# EAGLE design Speedometer_Drive_Board (EAGLE 9.2.2)
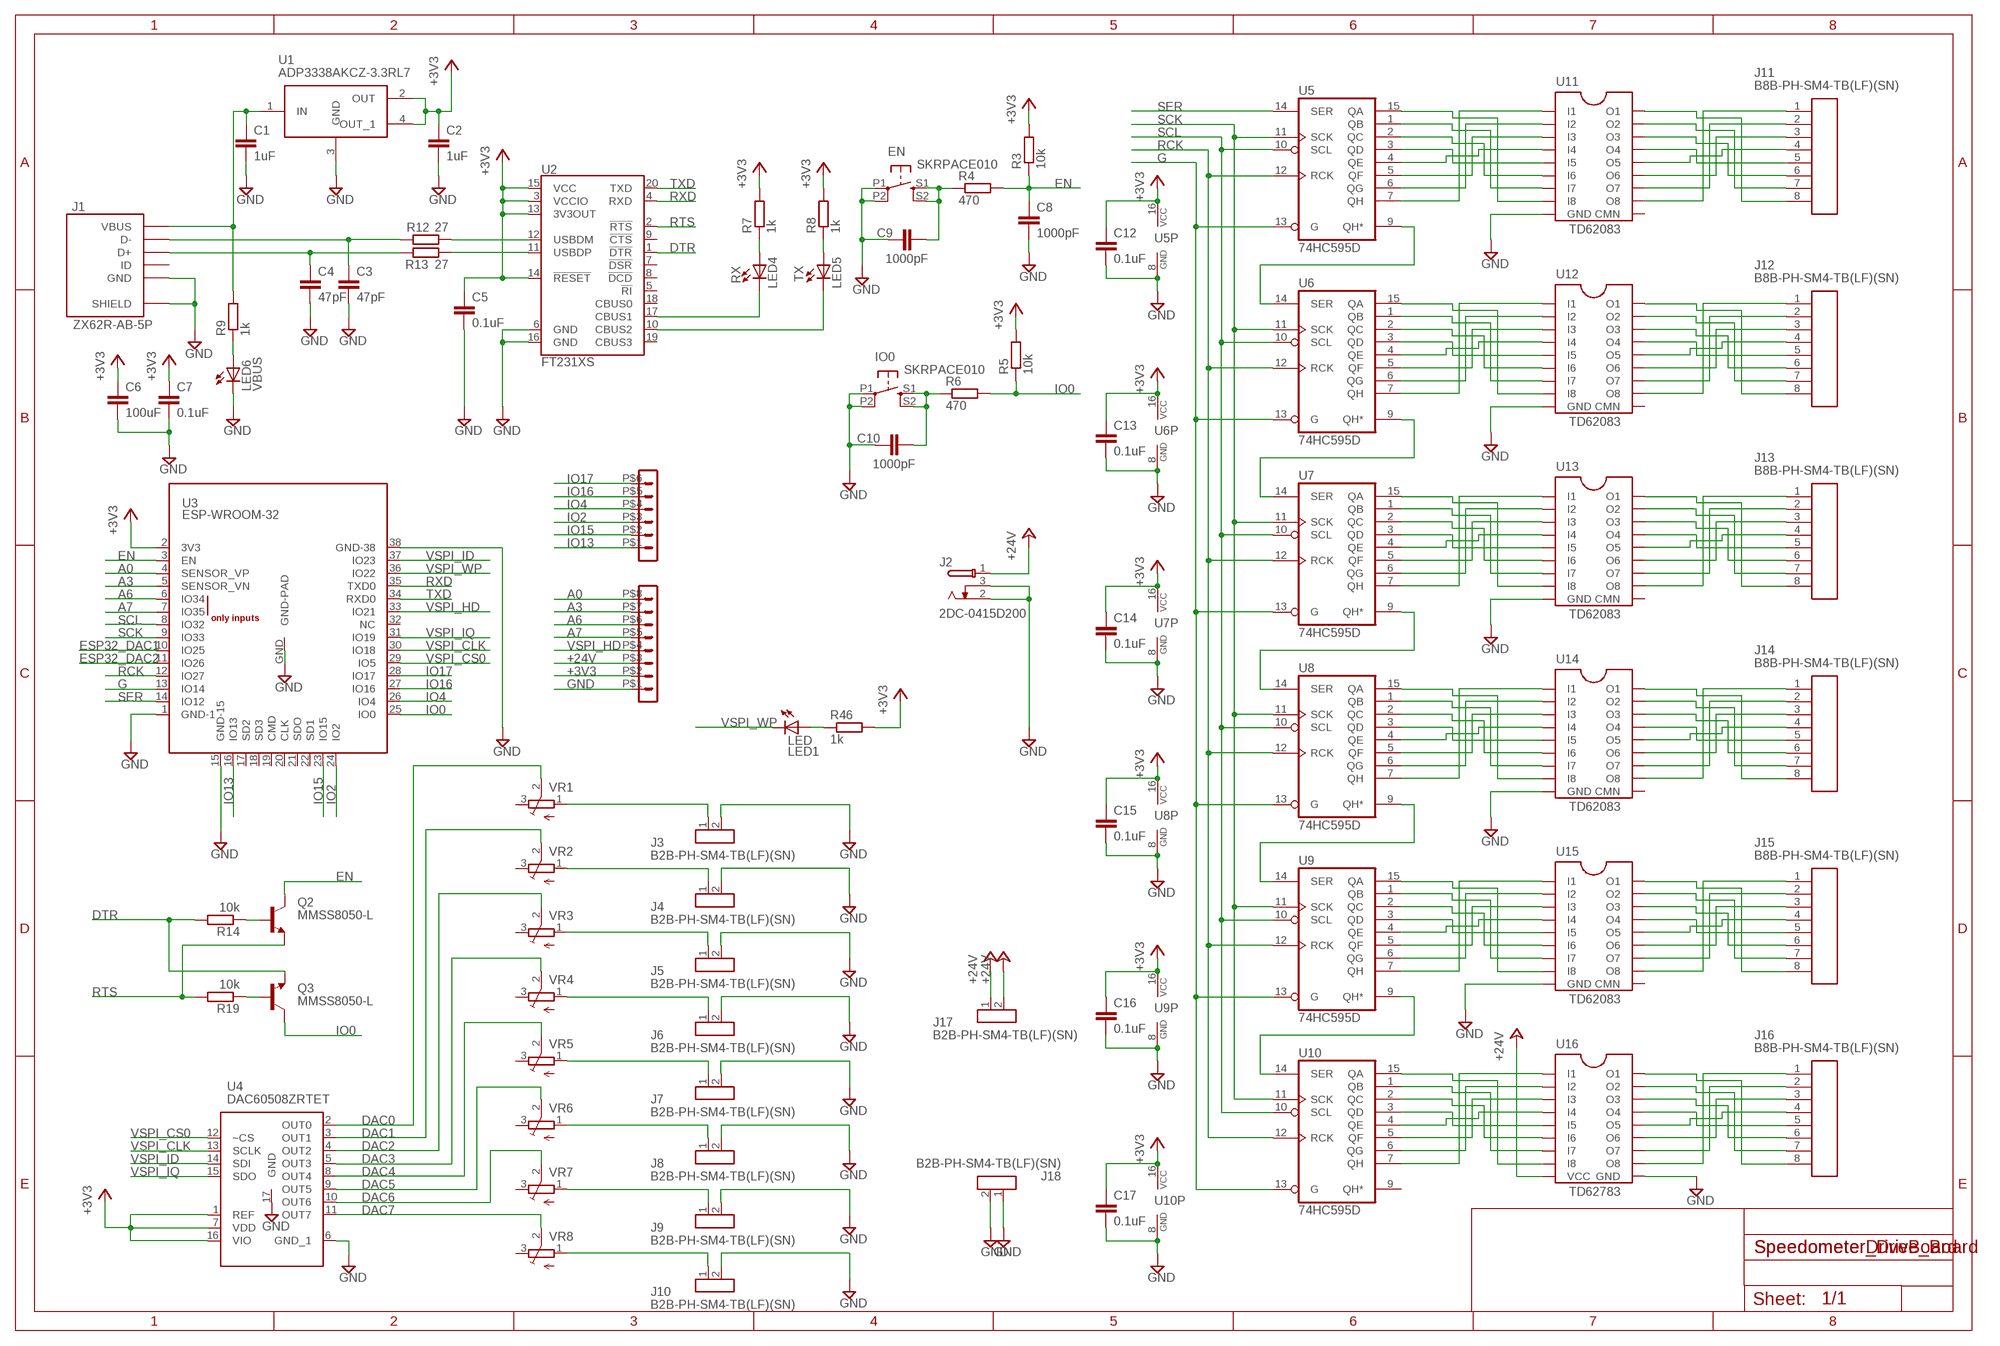
[diagram p0: schematic, sheet 1]

## Parts
C1  1uF  C-EUC0603  [C0603]
C2  1uF  C-EUC0603  [C0603]
C3  47pF  C-EUC0603  [C0603]
C4  47pF  C-EUC0603  [C0603]
C5  0.1uF  C-EUC0603  [C0603]
C6  100uF  C-EUC1210  [C1210]
C7  0.1uF  C-EUC0603  [C0603]
C8  1000pF  C-EUC0603  [C0603]
C9  1000pF  C-EUC0603  [C0603]
C10  1000pF  C-EUC0603  [C0603]
C12  0.1uF  C-EUC0603  [C0603]
C13  0.1uF  C-EUC0603  [C0603]
C14  0.1uF  C-EUC0603  [C0603]
C15  0.1uF  C-EUC0603  [C0603]
C16  0.1uF  C-EUC0603  [C0603]
C17  0.1uF  C-EUC0603  [C0603]
EN  SKRPACE010  [SKRPACE010]
IO0  SKRPACE010  [SKRPACE010]
J1  ZX62R-AB-5P  [ZX62R-B-5PA]
J2  2DC-0415D200  [2DC-0415D200]
J3  B2B-PH-SM4-TB(LF)(SN)  [SAMACSYS_PARTS_B2B-PH-SM4-TB]
J4  B2B-PH-SM4-TB(LF)(SN)  [SAMACSYS_PARTS_B2B-PH-SM4-TB]
J5  B2B-PH-SM4-TB(LF)(SN)  [SAMACSYS_PARTS_B2B-PH-SM4-TB]
J6  B2B-PH-SM4-TB(LF)(SN)  [SAMACSYS_PARTS_B2B-PH-SM4-TB]
J7  B2B-PH-SM4-TB(LF)(SN)  [SAMACSYS_PARTS_B2B-PH-SM4-TB]
J8  B2B-PH-SM4-TB(LF)(SN)  [SAMACSYS_PARTS_B2B-PH-SM4-TB]
J9  B2B-PH-SM4-TB(LF)(SN)  [SAMACSYS_PARTS_B2B-PH-SM4-TB]
J10  B2B-PH-SM4-TB(LF)(SN)  [SAMACSYS_PARTS_B2B-PH-SM4-TB]
J11  B8B-PH-SM4-TB(LF)(SN)  [SAMACSYS_PARTS_B8B-PH-SM4-TB]
J12  B8B-PH-SM4-TB(LF)(SN)  [SAMACSYS_PARTS_B8B-PH-SM4-TB]
J13  B8B-PH-SM4-TB(LF)(SN)  [SAMACSYS_PARTS_B8B-PH-SM4-TB]
J14  B8B-PH-SM4-TB(LF)(SN)  [SAMACSYS_PARTS_B8B-PH-SM4-TB]
J15  B8B-PH-SM4-TB(LF)(SN)  [SAMACSYS_PARTS_B8B-PH-SM4-TB]
J16  B8B-PH-SM4-TB(LF)(SN)  [SAMACSYS_PARTS_B8B-PH-SM4-TB]
J17  B2B-PH-SM4-TB(LF)(SN)  [SAMACSYS_PARTS_B2B-PH-SM4-TB]
J18  B2B-PH-SM4-TB(LF)(SN)  [SAMACSYS_PARTS_B2B-PH-SM4-TB]
J19  PIN_HEADER_MALE_1X06_06P  [PIN_HEADER_MALE_1X06_06P]
J20  PIN_HEADER_MALE_1X08_08P  [PIN_HEADER_MALE_1X08_08P]
LED  LED1  LEDCHIPLED_0603  [CHIPLED_0603]
LED4  RX  LEDCHIPLED_0603  [CHIPLED_0603]
LED5  TX  LEDCHIPLED_0603  [CHIPLED_0603]
LED6  VBUS  LEDCHIPLED_0603  [CHIPLED_0603]
Q2  MMSS8050-L  [SOT23]
Q3  MMSS8050-L  [SOT23]
R3  10k  R-EU_R0603  [R0603]
R4  470  R-EU_R0603  [R0603]
R5  10k  R-EU_R0603  [R0603]
R6  470  R-EU_R0603  [R0603]
R7  1k  R-EU_R0603  [R0603]
R8  1k  R-EU_R0603  [R0603]
R9  1k  R-EU_R0603  [R0603]
R12  27  R-EU_R0603  [R0603]
R13  27  R-EU_R0603  [R0603]
R14  10k  R-EU_R0603  [R0603]
R19  10k  R-EU_R0603  [R0603]
R46  1k  R-EU_R0603  [R0603]
U1  ADP3338AKCZ-3.3RL7  [SOT230P700X180-4N]
U2  FT231XS  [SSOP20_L]
U3  ESP-WROOM-32  [ESP-WROOM-32]
U4  DAC60508ZRTET  [SAMACSYS_PARTS_QFN50P300X300X80-17N]
U5  74HC595D  [SO16]
U6  74HC595D  [SO16]
U7  74HC595D  [SO16]
U8  74HC595D  [SO16]
U9  74HC595D  [SO16]
U10  74HC595D  [SO16]
U11  TD62083  [SO18]
U12  TD62083  [SO18]
U13  TD62083  [SO18]
U14  TD62083  [SO18]
U15  TD62083  [SO18]
U16  TD62783  [SO18]
VR1  TRIM_EU-SM-42/43W  [SM-42/43W]
VR2  TRIM_EU-SM-42/43W  [SM-42/43W]
VR3  TRIM_EU-SM-42/43W  [SM-42/43W]
VR4  TRIM_EU-SM-42/43W  [SM-42/43W]
VR5  TRIM_EU-SM-42/43W  [SM-42/43W]
VR6  TRIM_EU-SM-42/43W  [SM-42/43W]
VR7  TRIM_EU-SM-42/43W  [SM-42/43W]
VR8  TRIM_EU-SM-42/43W  [SM-42/43W]

## Nets
+3V3: C2.1 C5.1 C6.1 C7.1 C12.1 C13.1 C14.1 C15.1 C16.1 C17.1 J20.P$2 R3.2 R5.2 R7.2 R8.2 R46.2 U1.2(OUT) U1.4(OUT_1) U2.3(VCCIO) U2.13(3V3OUT) U2.14(!RESET) U2.15(VCC) U3.2(3V3) U4.1(REF) U4.7(VDD) U4.16(VIO) U5.16(VCC) U6.16(VCC) U7.16(VCC) U8.16(VCC) U9.16(VCC) U10.16(VCC)
+24V: J2.1 J17.1 J17.2 J20.P$3 U16.9(VCC)
A0: J20.P$8 U3.4(SENSOR_VP)
A3: J20.P$7 U3.5(SENSOR_VN)
A6: J20.P$6 U3.6(IO34)
A7: J20.P$5 U3.7(IO35)
D2_N1 [diffrencial pair]: R12.2 U2.12(USBDM)
D2_P1 [diffrencial pair]: R13.2 U2.11(USBDP)
D_N1 [diffrencial pair]: C3.1 J1.D- R12.1
D_P1 [diffrencial pair]: C4.1 J1.D+ R13.1
DAC0: U4.2(OUT0) VR1.2(S)
DAC1: U4.3(OUT1) VR2.2(S)
DAC2: U4.4(OUT2) VR3.2(S)
DAC3: U4.5(OUT3) VR4.2(S)
DAC4: U4.8(OUT4) VR5.2(S)
DAC5: U4.9(OUT5) VR6.2(S)
DAC6: U4.10(OUT6) VR7.2(S)
DAC7: U4.11(OUT7) VR8.2(S)
DTR: Q3.E R14.2 U2.1(!DTR)
EN: C8.1 Q2.C R3.1 R4.2 U3.3(EN)
ESP32_DAC1: U3.10(IO25)
ESP32_DAC2: U3.11(IO26)
G: U3.13(IO14) U5.13(G) U6.13(G) U7.13(G) U8.13(G) U9.13(G) U10.13(G)
GND: C1.2 C2.2 C3.2 C4.2 C5.2 C6.2 C7.2 C8.2 C9.1 C10.1 C12.2 C13.2 C14.2 C15.2 C16.2 C17.2 EN.P1(P) EN.P2(P1) IO0.P1(P) IO0.P2(P1) J1.GND J1.SHIELD@1(SHIELD) J1.SHIELD@2(SHIELD) J1.SHIELD@3(SHIELD) J1.SHIELD@4(SHIELD) J2.2 J2.3 J3.2 J4.2 J5.2 J6.2 J7.2 J8.2 J9.2 J10.2 J18.1 J18.2 J20.P$1 LED6.C U1.3(GND) U2.6(GND) U2.16(GND) U3.1(GND-1) U3.15(GND-15) U3.38(GND-38) U3.GND(GND-PAD) U4.6(GND_1) U4.17(GND) U5.8(GND) U6.8(GND) U7.8(GND) U8.8(GND) U9.8(GND) U10.8(GND) U11.9(GND) U12.9(GND) U13.9(GND) U14.9(GND) U15.9(GND) U16.10(GND)
IO0: Q3.C R5.1 R6.2 U3.25(IO0)
IO2: J19.P$3 U3.24(IO2)
IO4: J19.P$4 U3.26(IO4)
IO13: J19.P$1 U3.16(IO13)
IO15: J19.P$2 U3.23(IO15)
IO16: J19.P$5 U3.27(IO16)
IO17: J19.P$6 U3.28(IO17)
N$1: U5.9(QH*) U6.14(SER)
N$2: U6.9(QH*) U7.14(SER)
N$3: U7.9(QH*) U8.14(SER)
N$4: U5.7(QH) U11.1(I1)
N$5: U5.6(QG) U11.2(I2)
N$8: U5.5(QF) U11.3(I3)
N$9: LED.A R46.1
N$10: U5.4(QE) U11.4(I4)
N$11: U5.3(QD) U11.5(I5)
N$12: U5.2(QC) U11.6(I6)
N$13: U5.1(QB) U11.7(I7)
N$14: U5.15(QA) U11.8(I8)
N$15: J11.1(S1) U11.11(O8)
N$16: J11.2(S2) U11.12(O7)
N$17: J11.3(S3) U11.13(O6)
N$18: J11.4(S4) U11.14(O5)
N$20: J11.5(S5) U11.15(O4)
N$21: J11.6(S6) U11.16(O3)
N$22: J11.7(S7) U11.17(O2)
N$23: J11.8(S8) U11.18(O1)
N$24: U7.7(QH) U13.1(I1)
N$25: U6.7(QH) U12.1(I1)
N$26: U6.6(QG) U12.2(I2)
N$27: U6.5(QF) U12.3(I3)
N$28: U6.4(QE) U12.4(I4)
N$29: U6.3(QD) U12.5(I5)
N$30: U6.2(QC) U12.6(I6)
N$31: U6.1(QB) U12.7(I7)
N$32: U6.15(QA) U12.8(I8)
N$33: J12.1(S1) U12.11(O8)
N$34: J12.2(S2) U12.12(O7)
N$35: J12.3(S3) U12.13(O6)
N$36: J12.4(S4) U12.14(O5)
N$37: J12.5(S5) U12.15(O4)
N$38: J12.6(S6) U12.16(O3)
N$39: J12.7(S7) U12.17(O2)
N$40: J12.8(S8) U12.18(O1)
N$41: U7.6(QG) U13.2(I2)
N$42: U7.5(QF) U13.3(I3)
N$43: U7.4(QE) U13.4(I4)
N$44: U7.3(QD) U13.5(I5)
N$45: U7.2(QC) U13.6(I6)
N$46: U7.1(QB) U13.7(I7)
N$47: U7.15(QA) U13.8(I8)
N$48: J13.1(S1) U13.11(O8)
N$49: J13.2(S2) U13.12(O7)
N$50: J13.3(S3) U13.13(O6)
N$51: J13.4(S4) U13.14(O5)
N$52: J13.5(S5) U13.15(O4)
N$53: J13.6(S6) U13.16(O3)
N$54: J13.7(S7) U13.17(O2)
N$55: J13.8(S8) U13.18(O1)
N$56: U8.7(QH) U14.1(I1)
N$57: U8.6(QG) U14.2(I2)
N$58: U8.5(QF) U14.3(I3)
N$59: U8.4(QE) U14.4(I4)
N$60: U8.3(QD) U14.5(I5)
N$61: U8.2(QC) U14.6(I6)
N$62: U8.1(QB) U14.7(I7)
N$63: U8.15(QA) U14.8(I8)
N$64: J14.1(S1) U14.11(O8)
N$65: J14.2(S2) U14.12(O7)
N$66: J14.3(S3) U14.13(O6)
N$67: J14.4(S4) U14.14(O5)
N$68: J14.5(S5) U14.15(O4)
N$69: J14.6(S6) U14.16(O3)
N$70: J14.7(S7) U14.17(O2)
N$71: J14.8(S8) U14.18(O1)
N$72: U9.7(QH) U15.1(I1)
N$73: U9.6(QG) U15.2(I2)
N$74: U9.5(QF) U15.3(I3)
N$75: U9.4(QE) U15.4(I4)
N$76: U9.3(QD) U15.5(I5)
N$77: U9.2(QC) U15.6(I6)
N$78: U8.9(QH*) U9.14(SER)
N$79: U9.1(QB) U15.7(I7)
N$80: U9.15(QA) U15.8(I8)
N$81: J15.1(S1) U15.11(O8)
N$82: J15.2(S2) U15.12(O7)
N$83: J15.3(S3) U15.13(O6)
N$84: J15.4(S4) U15.14(O5)
N$85: J15.5(S5) U15.15(O4)
N$86: J15.6(S6) U15.16(O3)
N$87: J15.7(S7) U15.17(O2)
N$88: J15.8(S8) U15.18(O1)
N$89: U10.7(QH) U16.1(I1)
N$90: U10.6(QG) U16.2(I2)
N$91: U10.5(QF) U16.3(I3)
N$92: U10.4(QE) U16.4(I4)
N$93: U10.3(QD) U16.5(I5)
N$94: U10.2(QC) U16.6(I6)
N$95: U10.1(QB) U16.7(I7)
N$96: U9.9(QH*) U10.14(SER)
N$97: U10.15(QA) U16.8(I8)
N$98: J16.1(S1) U16.11(O8)
N$99: J16.2(S2) U16.12(O7)
N$100: J16.3(S3) U16.13(O6)
N$101: J16.4(S4) U16.14(O5)
N$102: J16.5(S5) U16.15(O4)
N$103: J16.6(S6) U16.16(O3)
N$104: J16.7(S7) U16.17(O2)
N$105: J16.8(S8) U16.18(O1)
N$120: J10.1 VR8.1(A)
N$121: J9.1 VR7.1(A)
N$122: J8.1 VR6.1(A)
N$123: J7.1 VR5.1(A)
N$124: J3.1 VR1.1(A)
N$125: J4.1 VR2.1(A)
N$126: J5.1 VR3.1(A)
N$127: J6.1 VR4.1(A)
N$128: C9.2 EN.S1(S) EN.S2(S1) R4.1
N$129: C10.2 IO0.S1(S) IO0.S2(S1) R6.1
N$130: LED4.C U2.17(CBUS1)
N$131: LED5.C U2.10(CBUS2)
N$132: LED4.A R7.1
N$133: LED5.A R8.1
N$134: LED6.A R9.1
N$136: Q2.B R14.1
N$137: Q3.B R19.1
RCK: U3.12(IO27) U5.12(RCK) U6.12(RCK) U7.12(RCK) U8.12(RCK) U9.12(RCK) U10.12(RCK)
RTS: Q2.E R19.2 U2.2(!RTS)
RXD: U2.4(RXD) U3.35(TXD0)
SCK: U3.9(IO33) U5.11(SCK) U6.11(SCK) U7.11(SCK) U8.11(SCK) U9.11(SCK) U10.11(SCK)
SCL: U3.8(IO32) U5.10(SCL) U6.10(SCL) U7.10(SCL) U8.10(SCL) U9.10(SCL) U10.10(SCL)
SER: U3.14(IO12) U5.14(SER)
TXD: U2.20(TXD) U3.34(RXD0)
VBUS3: C1.1 J1.VCC(VBUS) R9.2 U1.1(IN)
VSPI_CLK: U3.30(IO18) U4.13(SCLK)
VSPI_CS0: U3.29(IO5) U4.12(~CS)
VSPI_HD: J20.P$4 U3.33(IO21)
VSPI_ID: U3.37(IO23) U4.14(SDI)
VSPI_IQ: U3.31(IO19) U4.15(SDO)
VSPI_WP: LED.C U3.36(IO22)
Unconnected: J1.ID U2.5(!RI) U2.7(!DSR) U2.8(!DCD) U2.9(!CTS) U2.18(CBUS0) U2.19(CBUS3) U3.17(SD2) U3.18(SD3) U3.19(CMD) U3.20(CLK) U3.21(SDO) U3.22(SD1) U3.32(NC) U10.9(QH*) U11.10(CMN) U12.10(CMN) U13.10(CMN) U14.10(CMN) U15.10(CMN) VR1.3(E) VR2.3(E) VR3.3(E) VR4.3(E) VR5.3(E) VR6.3(E) VR7.3(E) VR8.3(E)

## Notes on the sheet
- SpeedometerDriveBoard

## Library data of the parts
C1-C10 C12-C17 = taki-library:C-EU: CAPACITOR, European symbol
EN IO0 = taki-library:SKRPACE010
J1 = taki-library:ZX62
J2 = taki-library:2DC-0415D200
J3-J10 J17 J18 = library:B2B-PH-SM4-TB(LF)(SN): Wire-To-Board Connector, PH Series, 2 Contacts, Header, 2 mm, Surface Mount, 1 Rows Source: Datasheet <http://uk.rs-online.com/web/p/products/6881325P>; DESCRIPTION: Wire-To-Board Connector, PH Series, 2 Contacts, Header, 2 mm, Surface Mount, 1 Rows; HEIGHT: mm; MANUFACTURER_NAME: JST (JAPAN SOLDERLESS TERMINALS); MANUFACTURER_PART_NUMBER: B2B-PH-SM4-TB(LF)(SN); RS_PART_NUMBER: 6881325P
J11-J16 = library:B8B-PH-SM4-TB(LF)(SN): PH SMT top entry shrouded header 8 way JST PH Series, 2mm Pitch 8 Way 1 Row Straight PCB Header, Solder Termination, 2A Source: Datasheet <http://uk.rs-online.com/web/p/products/1667263>; DESCRIPTION: PH SMT top entry shrouded header 8 way JST PH Series, 2mm Pitch 8 Way 1 Row Straight PCB Header, Solder Termination, 2A; HEIGHT: mm; MANUFACTURER_NAME: JST (JAPAN SOLDERLESS TERMINALS); MANUFACTURER_PART_NUMBER: B8B-PH-SM4-TB(LF)(SN); RS_PART_NUMBER: 1667263
J19 = 180118 Library by matsu:PIN_HEADER_MALE_1X06_06P
J20 = 180118 Library by matsu:PIN_HEADER_MALE_1X08_08P
LED LED4-LED6 = taki-library:LED: LED OSRAM: - CHIPLED LG R971, LG N971, LY N971, LG Q971, LY Q971, LO R971, LY R971 LH N974, LH R974 LS Q976, LO Q976, LY Q976 LO Q996 - Hyper CHIPLED LW Q18S LB Q993, LB Q99A, LB R99A - SideLED LS A670, LO A670, LY A670, LG A670, LP A670 LB A673, LV A673, LT A673, LW A673 LH A674 LY A675 LS A676, LA A676, LO A676, LY A676, LW A676 LS A679, LY A679, LG A679 - Hyper Micro SIDELED® LS Y876, LA Y876, LO Y876, LY Y876 LT Y87S - SmartLED LW L88C, LW L88S LB L89C, LB L89S, LG L890 LS L89K, LO L89K, LY L89K LS L896, LA L896, LO L896, LY L896 - TOPLED LS T670, LO T670, LY T670, LG T670, LP T670 LSG T670, LSP T670, LSY T670, LOP T670, LYG T670 LG T671, LOG T671, LSG T671 LB T673, LV T673, LT T673, LW T673 LH T674 LS T676, LA T676, LO T676, LY T676, LB T676, LH T676, LSB T676, LW T676 LB T67C, LV T67C, LT T67C, LS T67K, LO T67K, LY T67K, LW E67C LS E67B, LA E67B, LO E67B, LY E67B, LB E67C, LV E67C, LT E67C LW T67C LS T679, LY T679, LG T679 LS T770, LO T770, LY T770, LG T770, LP T770 LB T773, LV T773, LT T773, LW T773 LH T774 LS E675, LA E675, LY E675, LS T675 LS T776, LA T776, LO T776, LY T776, LB T776 LHGB T686 LT T68C, LB T68C - Hyper Mini TOPLED® LB M676 - Mini TOPLED Santana® LG M470 LS M47K, LO M47K, LY M47K Source: http://www.osram.convergy.de LUXEON: - LUMILED® LXK2-PW12-R00, LXK2-PW12-S00, LXK2-PW14-U00, LXK2-PW14-V00 LXK2-PM12-R00, LXK2-PM12-S00, LXK2-PM14-U00 LXK2-PE12-Q00, LXK2-PE12-R00, LXK2-PE12-S00, LXK2-PE14-T00, LXK2-PE14-U00 LXK2-PB12-K00, LXK2-PB12-L00, LXK2-PB12-M00, LXK2-PB14-N00, LXK2-PB14-P00, LXK2-PB14-Q00 LXK2-PR12-L00, LXK2-PR12-M00, LXK2-PR14-Q00, LXK2-PR14-R00 LXK2-PD12-Q00, LXK2-PD12-R00, LXK2-PD12-S00 LXK2-PH12-R00, LXK2-PH12-S00 LXK2-PL12-P00, LXK2-PL12-Q00, LXK2-PL12-R00 Source: www.luxeon.com KINGBRIGHT: KA-3528ASYC Source: www.kingbright.com
Q2 Q3 = taki-library:MMSS8050: Bipolar (BJT) Transistor NPN 25V 1.5A 100MHz 625mW Surface Mount SOT-23; DIGIKEY_URL: https://www.digikey.jp/product-detail/ja/micro-commercial-co/MMSS8050-L-TP/MMSS8050-L-TPMSCT-ND/2827203; MARUTSU_URL: https://www.marutsu.co.jp/pc/i/15861860/; STORE: MARUTSU; URL: https://www.marutsu.co.jp/pc/i/15861860/
R3-R9 R12-R14 R19 R46 = taki-library:R-EU_: RESISTOR, European symbol
U1 = library:ADP3338AKCZ-3.3RL7: LDO Regulator 3.3V 1.6A Analog Devices ADP3338AKCZ-3.3RL7, LDO Voltage Regulator, 1.6A, 3.3 V 0.8%, 2.7 8 Vin, 4-Pin SOT-223 Source: Datasheet <http://uk.rs-online.com/web/p/products/9126350>; DESCRIPTION: LDO Regulator 3.3V 1.6A Analog Devices ADP3338AKCZ-3.3RL7, LDO Voltage Regulator, 1.6A, 3.3 V 0.8%, 2.7 8 Vin, 4-Pin SOT-223; HEIGHT: 1.8mm; MANUFACTURER_NAME: Analog Devices; MANUFACTURER_PART_NUMBER: ADP3338AKCZ-3.3RL7; RS_PART_NUMBER: 9126350
U2 = taki-library:FT231X: FTDI FT231X Full Speed USB to Full-handshake UART This USB2.0 Full Speed IC offers a compact bridge to full handshake UART interfaces. The device is a UART, capable of operating up to 3MBaud, with low power consumption (8mA). The FT231X includes the complete FT-X series feature set and enables USB to be added into a system design quickly and easily over a UART interface. Datasheet <http://cdn.sparkfun.com/datasheets/Components/General%20IC/DS_FT231X.pdf> SparkFun Products SparkFun RedBoard - Programmed with Arduino <https://www.sparkfun.com/products/12757> (DEV-12757) SparkFun XBee Explorer USB <https://www.sparkfun.com/products/11812> (WRL-11812) SparkFun XBee Explorer Dongle <https://www.sparkfun.com/products/11697> (WRL-11697) SparkFun Blynk Board - ESP8266 <https://www.sparkfun.com/products/13794> (WRL-13794) SparkFun ESP8266 Thing - Dev Board <https://www.sparkfun.com/products/13711> (WRL-13711) SparkFun Block for Intel® Edison - Base <https://www.sparkfun.com/products/13045> (DEV-13045) SparkFun RedStick <https://www.sparkfun.com/products/13741> (DEV-13741) SparkFun Beefy 3 - FTDI Basic Breakout <https://www.sparkfun.com/products/13746> (DEV-13746) SparkFun FT231X Breakout <https://www.sparkfun.com/products/11736> (BOB-11736); PROD_ID: IC-11524
U3 = taki-library:ESP-WROOM-32
U4 = library:DAC60508ZRTET: TEXAS INSTRUMENTS - DAC60508ZRTET - DAC, VOLTAGE OUT, 12BIT, WQFN-16 Source: Datasheet <http://www.ti.com/lit/ds/symlink/dac70508.pdf>; DESCRIPTION: TEXAS INSTRUMENTS - DAC60508ZRTET - DAC, VOLTAGE OUT, 12BIT, WQFN-16; HEIGHT: 0.8mm; MANUFACTURER_NAME: Texas Instruments; MANUFACTURER_PART_NUMBER: DAC60508ZRTET; MOUSER_PART_NUMBER: 595-DAC60508ZRTET
U5-U10 = taki-library:74*595: 8-bit SHIFT REGISTER, output latch
U11-U15 = taki-library:TD62083: 8ch Darlington Sink Driver Source: http://akizukidenshi.com/download/TD62083AP.pdf
U16 = taki-library:TD62783: 8ch Darlington Sink Driver Source: http://akizukidenshi.com/download/TD62083AP.pdf
VR1-VR8 = 180118 Library by matsu:TRIM_EU-: POTENTIOMETER

## Net classes
1 POWER: width 0.254 mm
2 diffrencial pair: width 0.15 mm, clearance 0.3 mm to class 0, clearance 0.3 mm to class 1, clearance 0.15 mm

## Board
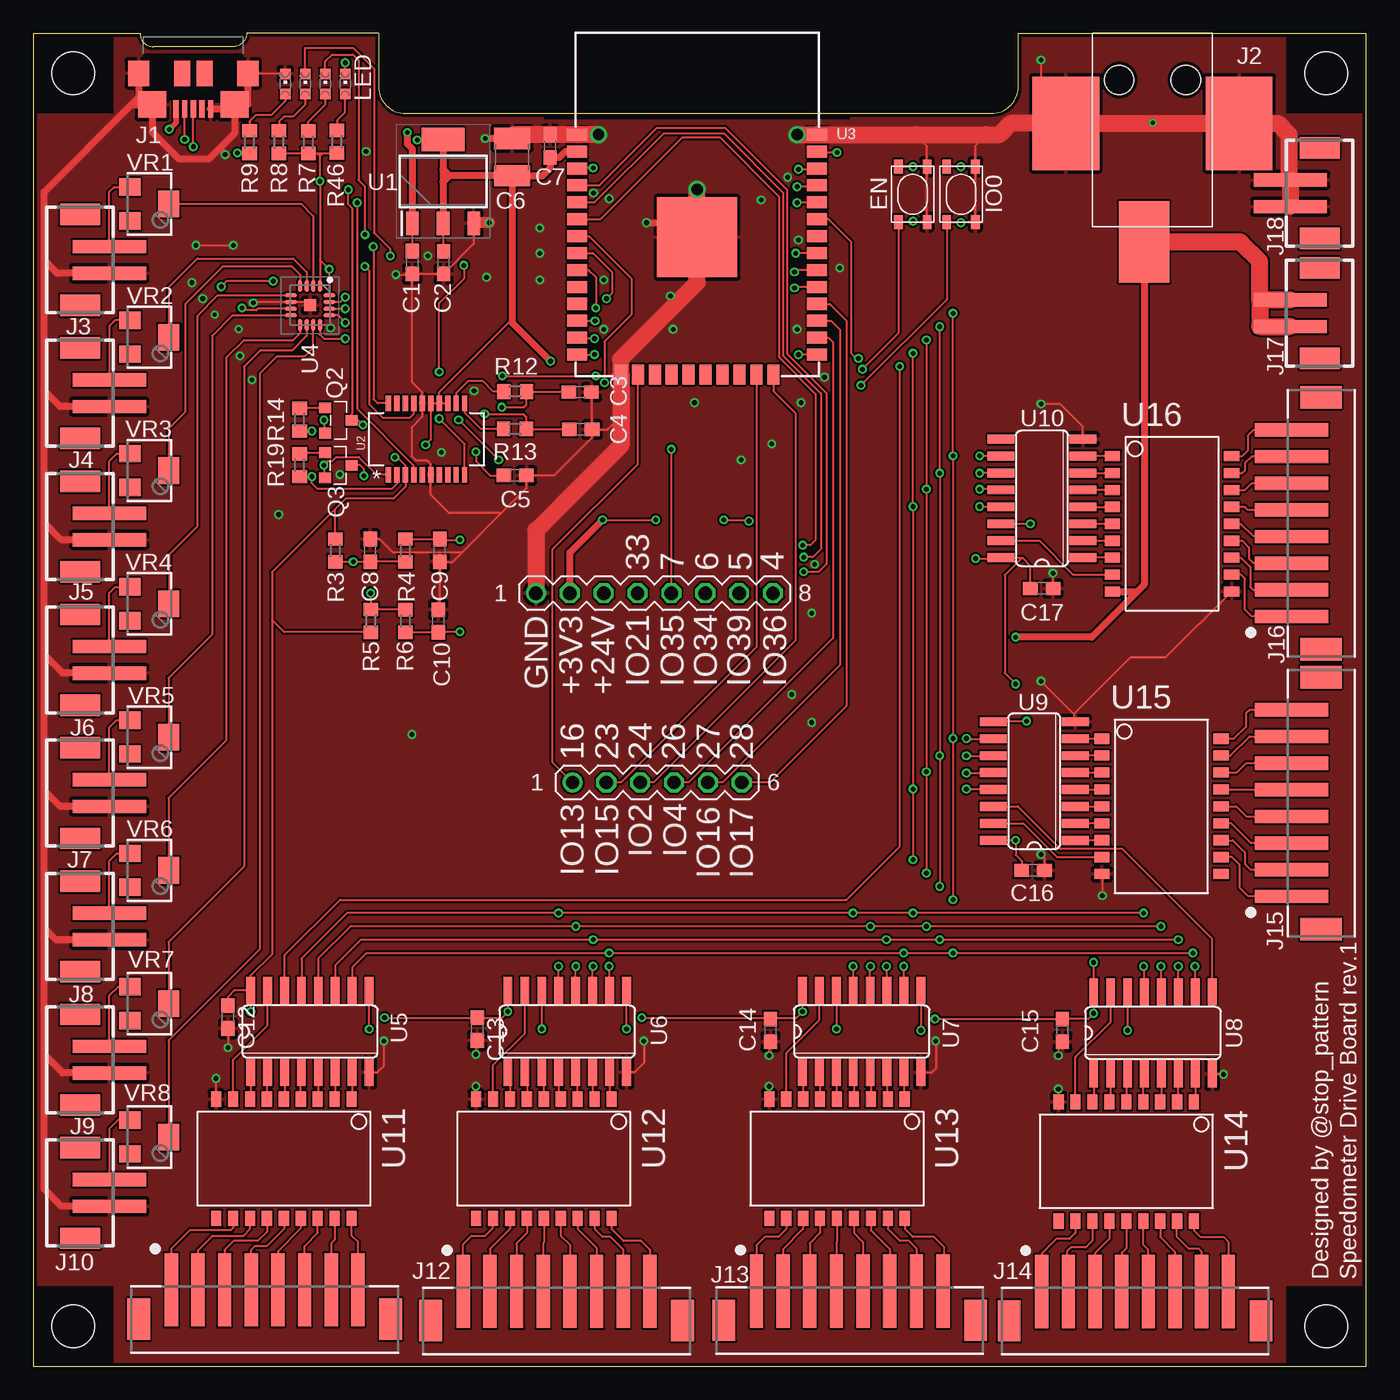
[diagram p1: board, top side]
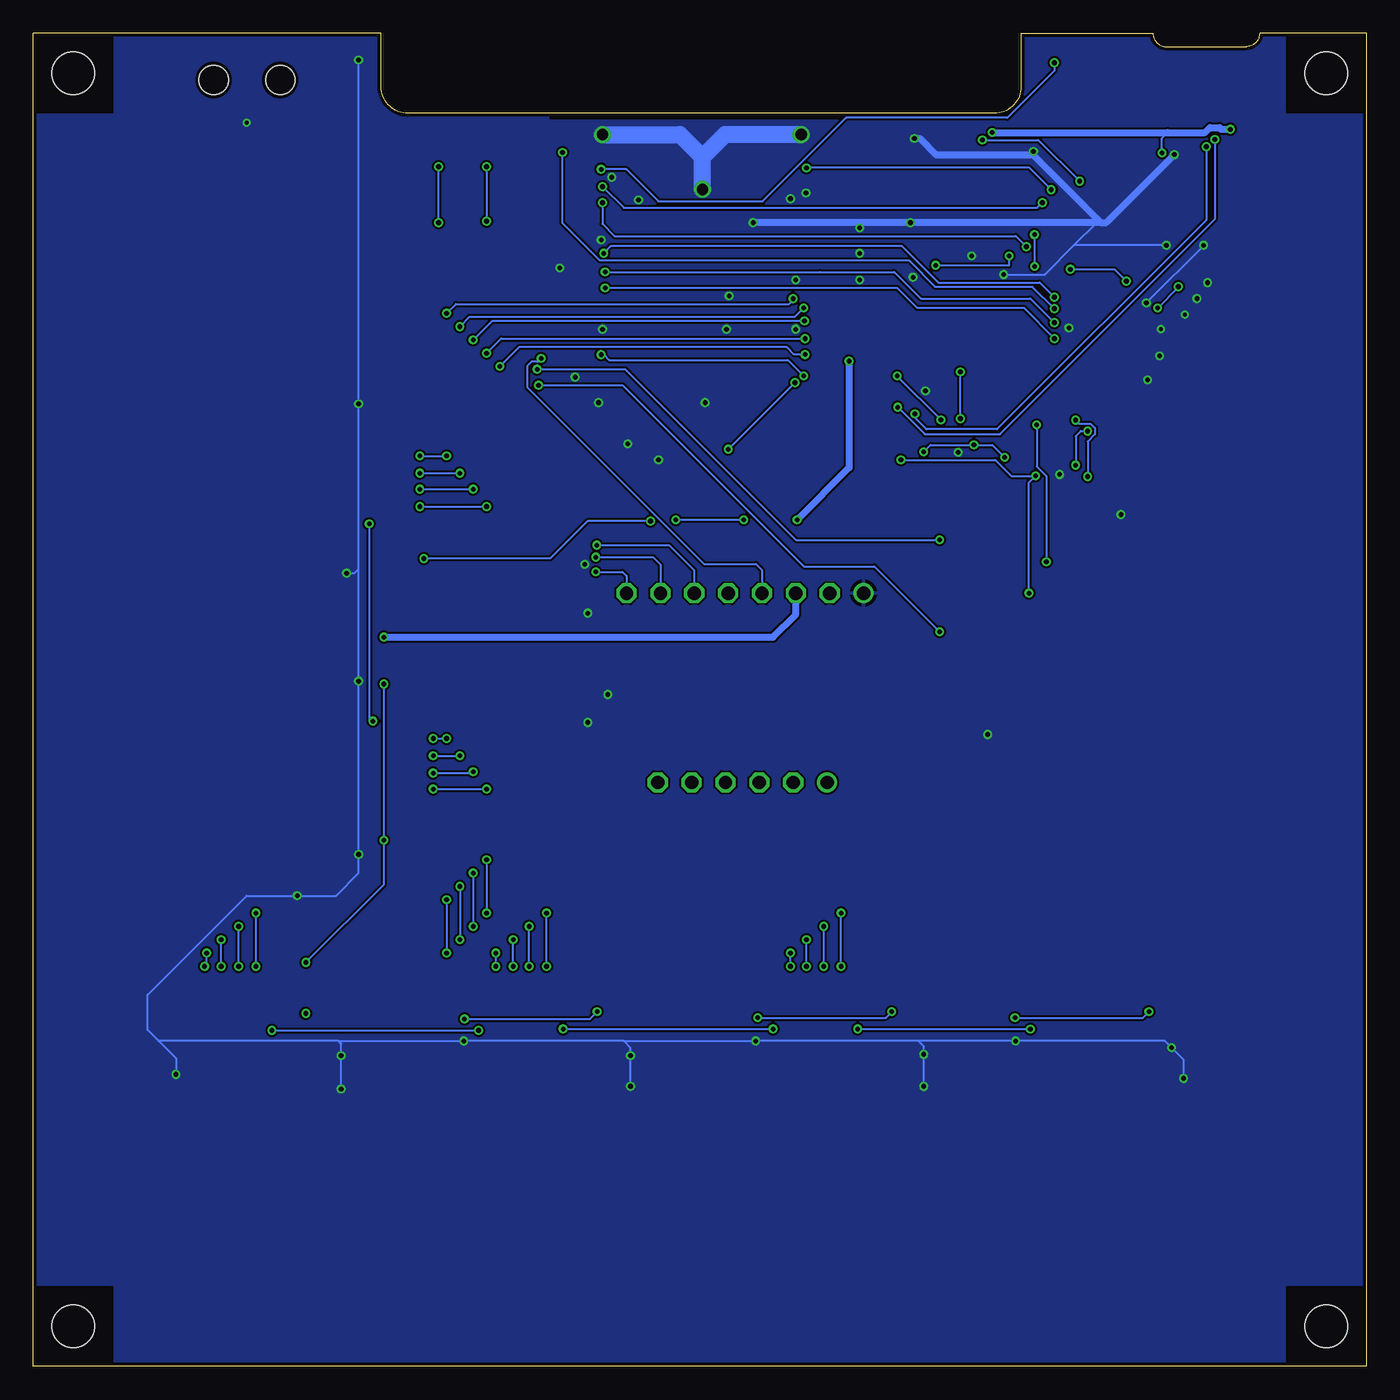
[diagram p2: board, bottom side, seen from below]

Size 100 x 100 mm. Coordinates in mm from the lower left corner, seen from the top.
Outline: 0,0 100,0 100,100 73.9,100 73.9,96 arc-90 71.9,94 27.9,94 arc-90 25.9,96 25.9,100 16,100 arc-90 15,99 9,99 arc-90 8,100 0,100 0,0
Copper layers (1*16): Top 0.035mm / dielectric 1.5mm / Bottom 0.035mm
Design rules "Elecrow_2-layer_eagle_rule": minimum track width 6mil, minimum drill 12mil, track to track 6mil, track to pad 6mil, pad to pad 6mil, via to via 6mil, smd to smd 0mil, copper to edge 10mil, drill to drill 10mil, minimum pad ring 10mil, minimum via ring 6mil, stop-mask expansion 2mil, vias tented up to drill 100mil, thermal gap 10mil
Holes 3.2 mm at 3,97 97,97 97,3 3,3
tRestrict: area 0,94 to 6,100; area 94,0 to 100,6; area 94,94 to 100,100; area 0,0 to 6,6
bRestrict: area 0,94 to 6,100; area 94,94 to 100,100; area 94,0 to 100,6; area 0,0 to 6,6

### Footprints (pad centres in the part's own frame; a part is rotated, then mirrored left to right if it is on the bottom)
C0603 = smd 1.1 x 1: 1 -0.85,0; 2 0.85,0
C1210 = smd 1.6 x 2.7: 1 -1.4,0; 2 1.4,0
SKRPACE010 = smd 1.05 x 0.65: P1 -2.075,-1.075; P2 2.075,-1.075; S1 -2.075,1.075; S2 2.075,1.075
ZX62R-B-5PA = smd 0.4 x 1.35: D+ 0,2.675; D- 0.65,2.675; GND -1.3,2.675; ID -0.65,2.675; VCC 1.3,2.675 | smd 1.2 x 1.9: NC@1 -0.85,0; NC@2 0.85,0 | smd 2.1 x 2: SHIELD@1 -3.1,2.35; SHIELD@2 3.1,2.35 | smd 1.6 x 1.9: SHIELD@3 -4.1,0; SHIELD@4 4.1,0
2DC-0415D200 = smd 6.1 x 3.8: 1 15.65,-0.63 | smd 7 x 5: 2 6.75,6.5; 3 6.75,-6.5 | hole 2.2: 3.5,2.5; 3.5,-2.5
SAMACSYS_PARTS_B2B-PH-SM4-TB = smd 1 x 5.5: 1 -1,0; 2 1,0 | smd 1.6 x 3: 3 -3.4,-2.2; 4 3.4,-2.2
SAMACSYS_PARTS_B8B-PH-SM4-TB = smd 1 x 5.5: 1 4,0; 2 2,0; 3 0,0; 4 -2,0; 5 -4,0; 6 -6,0; 7 -8,0; 8 -10,0 | smd 1.7 x 3.1: 9 -12.45,2.2; 10 6.45,2.2
PIN_HEADER_MALE_1X06_06P = drill 1: P$1 -6.35,0 | drill 1 octagon: P$2 -3.81,0; P$3 -1.27,0; P$4 1.27,0; P$5 3.81,0; P$6 6.35,0
PIN_HEADER_MALE_1X08_08P = drill 1: P$1 -8.89,0 | drill 1 octagon: P$2 -6.35,0; P$3 -3.81,0; P$4 -1.27,0; P$5 1.27,0; P$6 3.81,0; P$7 6.35,0; P$8 8.89,0
CHIPLED_0603 = smd 0.8 x 0.8: A 0,-0.75; C 0,0.75
SOT23 = smd 0.8 x 0.9: B -0.95,-1; C 0,1; E 0.95,-1
R0603 = smd 1 x 1.1: 1 -0.85,0; 2 0.85,0
SOT230P700X180-4N = smd 1.75 x 0.95: 1 -3.15,2.3; 2 -3.15,0; 3 -3.15,-2.3 | smd 1.75 x 3.2: 4 3.15,0
SSOP20_L = smd 0.4 x 1.143: 1 -2.857,-2.68; 2 -2.223,-2.68; 3 -1.587,-2.68; 4 -0.953,-2.68; 5 -0.318,-2.68; 6 0.318,-2.68; 7 0.953,-2.68; 8 1.587,-2.68; 9 2.223,-2.68; 10 2.857,-2.68; 11 2.857,2.68; 12 2.223,2.68; 13 1.587,2.68; 14 0.953,2.68; 15 0.318,2.68; 16 -0.318,2.68; 17 -0.953,2.68; 18 -1.587,2.68; 19 -2.223,2.68; 20 -2.857,2.68
ESP-WROOM-32 = smd 0.9 x 1.5: 1 7.7,9; 2 6.43,9; 3 5.16,9; 4 3.89,9; 5 2.62,9; 6 1.35,9; 7 0.08,9; 8 -1.19,9; 9 -2.46,9; 10 -3.73,9; 11 -5,9; 12 -6.27,9; 13 -7.54,9; 14 -8.81,9; 25 -8.81,-9; 26 -7.54,-9; 27 -6.27,-9; 28 -5,-9; 29 -3.73,-9; 30 -2.46,-9; 31 -1.19,-9; 32 0.08,-9; 33 1.35,-9; 34 2.62,-9; 35 3.89,-9; 36 5.16,-9; 37 6.43,-9; 38 7.7,-9 | smd 1.5 x 0.9: 15 -10.3,5.715; 16 -10.3,4.445; 17 -10.3,3.175; 18 -10.3,1.905; 19 -10.3,0.635; 20 -10.3,-0.635; 21 -10.3,-1.905; 22 -10.3,-3.175; 23 -10.3,-4.445; 24 -10.3,-5.715 | smd 6 x 6: GND 0,0
SAMACSYS_PARTS_QFN50P300X300X80-17N = smd 0.9 x 0.3: 1 -1.45,0.75; 2 -1.45,0.25; 3 -1.45,-0.25; 4 -1.45,-0.75; 9 1.45,-0.75; 10 1.45,-0.25; 11 1.45,0.25; 12 1.45,0.75 | smd 0.3 x 0.9: 5 -0.75,-1.45; 6 -0.25,-1.45; 7 0.25,-1.45; 8 0.75,-1.45; 13 0.75,1.45; 14 0.25,1.45; 15 -0.25,1.45; 16 -0.75,1.45 | smd 0.9 x 0.9: 17 0,0
SO16 = smd 0.66 x 2.032: 1 -4.445,-3.073; 2 -3.175,-3.073; 3 -1.905,-3.073; 4 -0.635,-3.073; 5 0.635,-3.073; 6 1.905,-3.073; 7 3.175,-3.073; 8 4.445,-3.073; 9 4.445,3.073; 10 3.175,3.073; 11 1.905,3.073; 12 0.635,3.073; 13 -0.635,3.073; 14 -1.905,3.073; 15 -3.175,3.073; 16 -4.445,3.073
SO18 = smd 0.762 x 1.143: 1 -5.08,-3.835; 2 -3.81,-3.835; 3 -2.54,-3.835; 4 -1.27,-3.835; 5 0,-3.835; 6 1.27,-3.835; 7 2.54,-3.835; 8 3.81,-3.835; 9 5.08,-3.835; 10 5.08,5.105; 11 3.81,5.105; 12 2.54,5.105; 13 1.27,5.105; 14 0,5.105; 15 -1.27,5.105; 16 -2.54,5.105; 17 -3.81,5.105; 18 -5.08,5.105
SM-42/43W = smd 1.3 x 1.6: 1 -1.27,-1.45; 3 1.27,-1.45 | smd 2 x 1.6: 2 0,1.45

### Placement (x,y rotation side)
C1  28.43,82.81 270 top
C2  30.78,82.79 270 top
C3  41.02,73.08 0 top
C4  41.07,70.28 0 top
C5  36.14,66.83 0 top
C6  35.92,90.72 90 top
C7  38.77,91.54 90 top
C8  25.28,61.21 90 top
C9  30.49,61.21 90 top
C10  30.38,55.91 270 top
C12  14.6,26.2 270 top
C13  33.3,25.3 270 top
C14  55.3,25.2 270 top
C15  77.2,25.2 270 top
C16  75,37.2 0 top
C17  75.65,58.35 0 top
EN  65.98,87.92 90 top
IO0  69.61,87.92 90 top
J1  12,97 180 top
J2  83.97,100 270 top
J3  5.7,83 270 top
J4  5.7,73 270 top
J5  5.7,63 270 top
J6  5.7,53 270 top
J7  5.7,43 270 top
J8  5.7,33 270 top
J9  5.7,23 270 top
J10  5.7,13 270 top
J11  14.35,5.73 180 top
J12  36.25,5.62 180 top
J13  58.25,5.64 180 top
J14  79.65,5.61 180 top
J15  94.4,39.25 270 top
J16  94.41,60.25 270 top
J17  94.3,79 90 top
J18  94.3,88 90 top
J19  46.8,43.8 0 top
J20  46.6,58 0 top
LED  23.4,96.2 0 top
LED4  21.9,96.2 0 top
LED5  20.4,96.2 0 top
LED6  18.9,96.2 0 top
Q2  22.89,70.96 270 top
Q3  22.88,67.59 270 top
R3  22.65,61.21 90 top
R4  27.91,61.21 270 top
R5  25.33,55.92 270 top
R6  27.92,55.91 90 top
R7  20.63,91.83 270 top
R8  18.43,91.84 270 top
R9  16.23,91.85 270 top
R12  36.15,73.12 180 top
R13  36.13,70.32 180 top
R14  19.98,71.01 270 top
R19  19.98,67.59 270 top
R46  22.78,91.87 270 top
U1  30.74,88.89 90 top
U2  29.5,69.56 0 top
U3  49.8,84.7 90 top
U4  20.76,79.59 270 top
U5  20.75,25.11 0 top
U6  40.05,25.11 0 top
U7  62.15,25.11 0 top
U8  84,25 0 top
U9  75.1,43.9 90 top
U10  75.68,65.11 90 top
U11  18.8,16.2 180 top
U12  38.3,16.2 180 top
U13  60.3,16.2 180 top
U14  82,16 180 top
U15  84,42 270 top
U16  84.8,63.2 270 top
VR1  8.7,87.2 270 top
VR2  8.7,77.2 270 top
VR3  8.7,67.2 270 top
VR4  8.7,57.2 270 top
VR5  8.7,47.2 270 top
VR6  8.7,37.2 270 top
VR7  8.7,27.2 270 top
VR8  8.7,17.2 270 top

### Tracks (layer width: path | path; a pad name or v marks a point on that pad's centre or on a via)
+3V3  (via drill 0.35)
  Top 0.152: U10.16 72.9,60.66 | 72.9,60.66 74.19,60.66 | U2.14 U2.15 29.82,69.51 v29.43,69.12 | U2.14 U2.13 | v27.12,68.18 27.31,68.18 27.91,67.58 U2.3 27.91,65.98 27.01,65.08 23.41,65.08 22.65,64.32 | U1.2 30.74,83.68 C2.1 | U4.1 21.54,81.07 21.5,81.11 21.5,83 | 21.5,83 v21.5,88.9 21.5,90.78 | U7.16 v57.7,26.61 v57.7,26.6 57.25,26.15 55.3,26.15 | U6.16 v35.6,26.6 35.15,26.15 C13.1 v26.35,26.15 | v16.3,26.6 v16.3,26.61 U5.16 | v33.2,68.6 33.2,67.9 34.27,66.83 C5.1 | v79.56,30.3 U8.16 v79.56,26.48 v79.56,26.47 79.14,26.05 C15.1 v67.65,26.05 | 74.19,60.66 72.89,59.36 72.89,51.99 v73.7,51.18 | U5.16 16.3,29.3 17.9,30.9 17.9,56 | 17.9,56 17.9,59.57 22.65,64.32 | R3.2 22.65,64.32 | R5.2 18.83,55.07 17.9,56 | R8.2 R7.2 21.3,90.98 | R46.2 22.74,90.98 21.7,90.98 | 21.7,90.98 21.3,90.98 | 21.5,90.78 21.7,90.98 | U2.14 30.45,73.08 35.92,78.54 35.92,78.9 | 21.5,90.78 21.3,90.98 | v28.8,92 30.7,92 U1.4 | v42.7,63.5 v46.7,63.5 | v51.8,63.5 53.59,63.5 v53.69,63.4 | v70.7,60.6 72.83,60.6 72.9,60.66 | C16.1 74.15,37.9 73.7,38.35 v73.7,39.46 72.74,39.46 72.6,39.6 72.17,39.6 U9.16 | C17.1 74.8,60.05 74.19,60.66 | U5.16 15.08,28.18 14.6,27.7 C12.1 | v45.65,26.15 55.3,26.15 | C14.1 55.3,26.15 | 21.5,83 v22.2,82.3 v22.21,82.29 U4.16 | U4.7 16.84,79.34 16.73,79.23 15.81,79.23 v15.65,79.4 | v18,81.4 14.5,81.4 v14.1,81
  Top 0.508: J20.P$2 40.25,61.05 v42.7,63.5 | 35.92,89.3 C6.1 31.22,89.32 | 35.92,89.3 35.92,78.9 35.92,78.28 v38.8,75.4 | 35.92,89.3 38.18,89.3 38.77,89.89 C7.1 39.47,90.69 39.91,91.13 U3.2 | U1.4 30.74,89.8 | 30.74,89.8 30.74,88.84 | 30.74,88.84 U1.2 | 31.22,89.32 30.74,89.8 | 31.22,89.32 30.74,88.84
  Bottom 0.152: v27.12,68.18 28.06,69.12 v29.43,69.12 32.68,69.12 v33.2,68.6 | v21.5,88.9 24.6,92 v28.8,92 | v67.65,26.05 58.25,26.05 v57.7,26.6 | v45.65,26.15 36.05,26.15 v35.6,26.6 | v26.35,26.15 16.75,26.15 v16.3,26.6 | v79.56,30.3 73.7,36.16 v73.7,39.46 v73.7,51.18 | v46.7,63.5 v51.8,63.5 | v53.69,63.4 58.41,63.4 61.22,60.6 v70.7,60.6 | v15.65,79.4 14.1,80.94 v14.1,81 | v22.2,82.3 18.9,82.3 v18,81.4
  Bottom 0.508: v38.8,75.4 38.8,67.4 v42.7,63.5
+24V  (via drill 0.35)
  Top 0.508: 90.6,84.3 90.55,84.35 | J2.1 83.34,58.64 83.1,58.4 82.82,58.12 | 82.82,58.12 79.4,54.7 v73.7,54.7 | U16.9 82.82,58.12
  Top 1.27: 90.6,84.3 92,82.9 92,80 | J17.2 92,80 | J17.1 92,78 92,80 | 90.55,84.35 J2.1
  Bottom 0.508: v73.7,54.7 44.49,54.7 42.79,56.4 J20.P$3
A0  (via drill 0.35)
  Top 0.152: U3.4 42.49,88.59 46.8,92.9 51.9,92.9 56.54,88.26 56.54,75.96 59.49,73.01 59.49,60.2 58.9,59.6 v57.8,59.6
  Bottom 0.152: v57.8,59.6 55.8,59.6 55.49,59.29 J20.P$8
A3  (via drill 0.35)
  Top 0.152: U3.5 42.12,87.32 47.3,92.5 51.8,92.5 56.24,88.06 56.24,75.83 59.1,72.97 59.1,61.32 58.48,60.7 v57.8,60.7
  Bottom 0.152: v57.8,60.7 53.5,60.7 52.95,60.15 J20.P$7
A6  (via drill 0.35)
  Top 0.152: U3.6 42.55,86.05 48.7,92.19 51.5,92.19 55.93,87.76 55.93,75.71 58.7,72.95 58.7,62 58.3,61.6 v57.73,61.6
  Bottom 0.152: v57.73,61.6 52.3,61.6 50.41,59.71 J20.P$6
A7  (via drill 0.35)
  Top 0.152: v42.85,73.8 42.85,76.88 44.87,78.89 44.87,81.6 41.69,84.78 U3.7 | v47.85,68.8 47.87,68.78 J20.P$5
  Bottom 0.152: v47.85,68.8 v42.85,73.8
D2_N1
  Top 0.152: U2.12 31.72,73 32.62,73.91 33.73,73.91 34.51,73.12 R12.2
D2_P1
  Top 0.152: R13.2 33.58,70.32 32.36,71.54 U2.11
D_N1  (via drill 0.35)
  Top 0.152: v11.36,92.04 11.36,94.32 J1.D- | v35.15,71.95 36.83,71.95 37,72.12 R12.1 40.13,73.12 C3.1
  Bottom 0.152: v11.36,92.04 11.36,86.04 27.48,69.92 33.12,69.92 v35.15,71.95
D_P1  (via drill 0.35)
  Top 0.152: v12,91.5 J1.D+ | C4.1 37.02,70.28 R13.1 36.98,71.22 36.81,71.39 33.91,71.39 v33.86,71.44
  Bottom 0.152: v12,91.5 12,86 27.7,70.3 33,70.3 33.86,71.16 v33.86,71.44
DAC0
  Top 0.152: U4.2 21.01,86.3 20.11,87.2 VR1.2
DAC1
  Top 0.152: U4.3 20.51,82.09 19.5,83.1 12.3,83.1 10.15,80.95 VR2.2
DAC2
  Top 0.152: U4.4 20.01,81.89 19.4,82.5 14.2,82.5 11.4,79.7 11.4,71.6 10.15,70.35 VR3.2
DAC3
  Top 0.152: U4.5 13.84,80.34 12.3,78.8 12.3,63 10.2,60.9 10.2,57.25 VR4.2
DAC4
  Top 0.152: U4.8 14.94,78.84 13.4,77.3 13.4,54.9 10.15,51.65 VR5.2
DAC5
  Top 0.152: U4.9 20.01,77.51 19.5,77 15.8,77 14.5,75.7 14.5,47 10.15,42.65 VR6.2
DAC6
  Top 0.152: U4.10 20.51,77.31 19.4,76.2 17,76.2 15.8,75 15.8,37.5 10.15,31.85 VR7.2
DAC7
  Top 0.152: U4.11 21.01,76.41 20.4,75.8 18.3,75.8 17,74.5 17,31.3 10.15,24.45 VR8.2
DTR  (via drill 0.35)
  Top 0.152: Q3.E 21.8,66.72 v21.8,67.6 22.11,67.91 22.43,67.91 22.73,68.22 24.43,68.22 25.76,66.88 U2.1 | v20.91,70.16 R14.2
  Bottom 0.152: v21.8,67.6 21.8,69.77 21.41,70.16 v20.91,70.16
EN  (via drill 0.35)
  Top 0.152: R4.2 C8.1 v24,60.36 R3.1 | v42,89.9 40.84,89.9 U3.3 | v24.72,70.62 24.38,70.96 Q2.C 23.89,71.43 23.96,71.5 23.96,86.84 23.63,87.17 v23.63,88.27
  Bottom 0.152: v23.63,88.27 25.26,89.9 v42,89.9 | v24,60.36 24,66.79 24.72,67.51 v24.72,70.62
G  (via drill 0.35)
  Top 0.152: U8.13 83.36,29.93 v83.3,30 | U5.13 20.11,30.58 23.53,34 v39.4,34 v61.5,34 v66,34 v83.3,34 | v66,76 v66,64.5 v66,43.3 v66,38 | U10.13 71.03,64.47 v71,64.5 | U7.13 61.52,29.98 v61.5,30 | U6.13 39.41,29.98 v39.4,30 | v42.1,77.1 40.86,77.1 U3.13 | v70,43.3 71.99,43.3 U9.13
  Bottom 0.152: v83.3,30 v83.3,34 | v66,38 v66,34 | v71,64.5 v66,64.5 | v70,43.3 v66,43.3 | v61.5,30 v61.5,34 | v39.4,30 v39.4,34 | v66,76 64.9,77.1 v42.1,77.1
GND  (via drill 0.3, 0.35, 0.85)
  Top 0.152: IO0.P1 IO0.P2 | EN.P1 EN.P2 67.06,91.55 66.2,92.4 | U10.8 78.75,70.5 77.05,72.2 v75.6,72.2 | C1.2 30.76,81.96 C2.2 33.04,84.2 U1.3 | C6.2 35.8,92.12 | U4.17 20.51,79.84 U4.6 16.56,79.84 v16.5,79.78 | v12.2,84.1 v15,84.1 | C1.2 28.37,81.9 v27.2,81.9 | 79.2,91.8 77.75,93.25 J2.3 75.75,93.25 75.6,93.1 | U11.9 13.72,21.58 v13.7,21.6 | v75.6,98 75.6,93.1 | 75.6,93.1 75.5,93 | U14.9 76.92,20.78 v76.9,20.8 | U7.8 67.44,22.04 67.7,22.3 v67.7,24.4 | U13.9 55.22,20.98 v55.2,21 | 14.55,25.3 C12.2 v14.6,23.9 | U12.9 33.2,20.05 v33.2,21 | C9.1 30.49,60.3 | 30.49,60.3 30.49,56.87 C10.1 | C8.2 25.98,62.06 26.95,61.09 32.19,61.09 | U16.10 84.98,53.2 82.35,53.2 78.07,48.93 | C3.2 41.87,70.33 C4.2 | C4.2 41.92,69.68 39.07,66.83 C5.2 36.99,65.89 35.1,64 | 32.19,61.09 35.1,64 | 35.1,64 31.2,64 29.82,65.38 U2.6 29.82,67.68 29.57,67.93 28.73,67.93 28.42,68.24 28.42,70.47 29.18,71.24 U2.16 29.18,73.06 28.43,73.82 C1.2 | 32.19,61.09 31.4,60.3 30.49,60.3 | LED6.C 16.15,96.95 J1.SHIELD@3 | IO0.P2 70.69,89.22 70.7,89.2 | 75.8,37.2 C16.2 75.9,37.25 75.9,38.1 v75.6,38.4 | IO0.P2 70.69,91.58 71.5,92.4 | v76.5,59.5 C17.2 | 78.07,48.93 v75.6,51.4 | v89.3,21.9 88.47,21.9 U8.8 | 77.1,24.4 77.1,24.35 C15.2 76.9,24.05 v76.9,23.3 | U5.8 25.8,22.04 26.3,22.54 v26.3,24.4 | C13.2 33.2,24.35 v33.2,23.4 | C14.2 55.2,24.25 v55.2,23.3 | U15.9 80.2,36.88 v80.2,35.3 | v45.8,24.4 45.8,22.74 45.09,22.04 U6.8 | C7.2 | C4.2 43.06,70.28 44.09,71.3 | 78.07,48.93 78.07,48.45 U9.8
  Top 0.508: J10.2 2.1,12 0.8,13.3 0.8,23.4 | 0.8,23.4 0.8,32.9 | 0.8,32.9 0.8,43.2 | 0.8,43.2 0.8,53.4 | 0.8,53.4 0.8,63.3 | 0.8,63.3 0.8,73.2 | 0.8,73.2 0.8,83 | 0.8,83 0.8,88.1 7.35,94.65 | J3.2 1.8,82 0.8,83 | J6.2 2.2,52 0.8,53.4 | J5.2 2.1,62 0.8,63.3 | J4.2 2,72 0.8,73.2 | J8.2 1.7,32 0.8,32.9 | J7.2 2,42 0.8,43.2 | J9.2 2.2,22 0.8,23.4 | J1.SHIELD@4 7.9,95.2 7.35,94.65 | 14,91.4 13.2,90.6 10.9,90.6 8.9,92.6 J1.SHIELD@2 7.35,94.65 | 14,91.4 15.1,92.5 15.1,94.4 | 15.1,94.4 J1.SHIELD@1 16.1,94.65 J1.SHIELD@3 | J1.GND 15.03,94.33 15.1,94.4 | 14,91.4 14,91.3 v14.4,90.9 | v46,85.8 49.4,85.8 49.8,85.4 | v33.9,92.12 35.8,92.12
  Top 0.813: 36.19,92.39 C6.2 | v34.2,85.8 33.1,85.8 U1.3
  Top 1.27: v57.3,92.4 U3.38 66.2,92.4 71.5,92.4 72.5,92.4 73.35,93.25 J2.3 J2.2 93.35,93.25 94.2,92.4 94.2,89.1 J18.2 J18.1 | v49.8,88.3 49.8,85.4 U3.GND 49.8,81.3 44.09,75.58 U3.15 | v42.4,92.4 U3.1 C7.2 36.08,92.4 35.8,92.12 | J20.P$1 37.71,62.71 44.09,69.08 44.09,71.3 U3.15 | U3.15 44.09,74.25
  Bottom 0.152: v16.5,79.78 12.2,84.08 v12.2,84.1 | v15,84.1 21.91,84.1 | 21.91,84.1 24.12,81.89 v27.2,81.89 v27.2,81.9 | v13.7,21.6 13.7,23 v14.6,23.9 15.1,24.4 v26.3,24.4 33.6,24.4 | 33.6,24.4 v45.8,24.4 55.7,24.4 | 55.7,24.4 v67.7,24.4 77.1,24.4 | 77.1,24.4 90.61,24.4 | 75.6,59.8 v75.6,51.4 v75.6,38.4 75.6,37 77.3,35.3 v80.2,35.3 84,35.3 91.43,27.87 91.43,25.22 90.61,24.4 | 75.6,59.8 v75.6,72.2 v75.6,98 | v76.9,20.8 v76.9,23.3 76.9,24.2 77.1,24.4 | v55.2,21 v55.2,23.3 55.2,23.9 55.7,24.4 | v33.2,21 v33.2,23.4 33.2,24 33.6,24.4 | 21.91,84.1 20.21,85.8 19.92,85.8 | v76.5,59.5 75.9,59.5 75.6,59.8 | 90.61,24.4 89.3,23.09 v89.3,21.9
  Bottom 0.508: v14.4,90.9 19.5,85.8 19.92,85.8 | 19.92,85.8 v34.2,85.8 v46,85.8 | 19.92,85.8 25,90.88 32.26,90.88 33.5,92.12 v33.9,92.12
  Bottom 1.27: v42.4,92.4 48.1,92.4 49.8,90.7 | v57.3,92.4 51.5,92.4 49.8,90.7 | v49.8,88.3 49.8,90.7
  other vias: 18.4,63.9 38,85.4 42.8,77.8 53.1,68 55.4,69.2 57.6,72.3 58.4,56.5 56.9,50.4 58.4,48.3 24.97,91.13 11.9,81.3 60.5,82.4 57.3,77.8 59.35,74.21 58.63,60.16 33.07,73.18 42.03,88.03 43.2,87.6 28.4,47.4 29.6,83.3 38,81.5 34,81.7 47.8,80.3 48,77.8 30.61,68.56 54.6,87.5 56.6,89.2 22.3,77.9 13.6,78.9 15.4,77.8 84,93.3 57.4,84.5 38.01,83.5 49.6,72.3 42.8,81.5 23,66.9 15.5,75.8 16.4,74 12.7,80.1
  pour Bottom: 100,-30.3 0,-30.3 0,100 100,100
  pour Top: 131.9,100 0,100 0,0 131.9,0
IO0  (via drill 0.35)
  Top 0.152: U3.25 v57.4,75.89 | R6.2 R5.1 25.33,57.97 v25.3,58 | v24.8,66.8 24.8,67.3 24.51,67.59 Q3.C | v31.9,71 v34.9,68 | v35.19,74.3 v42.2,74.3 v42.2,74.29
  Bottom 0.152: v34.9,68 27.83,68 26.63,66.8 v24.8,66.8 25.3,66.3 v25.3,58 | v57.4,75.89 57.2,75.89 56.8,75.49 43.4,75.49 v42.2,74.29 | v31.9,71 v35.19,74.29 v35.19,74.3
IO2
  Top 0.152: U3.24 55.52,73.17 57.17,71.51 57.17,54.44 46.53,43.8 J19.P$3
IO4
  Top 0.152: U3.26 59.65,77.16 60,76.81 60,54.63 49.17,43.8 J19.P$4
IO13
  Top 0.152: J19.P$1 38.97,45.28 38.97,61.3 45.35,67.68 U3.16
IO15
  Top 0.152: U3.23 54.24,53.95 44.09,43.8 J19.P$2
IO16
  Top 0.152: U3.27 59.85,78.43 60.5,77.78 60.5,52.59 51.71,43.8 J19.P$5
IO17
  Top 0.152: U3.28 59.75,79.7 61,78.45 61,49.55 55.25,43.8 J19.P$6
N$1  (via drill 0.35)
  Top 0.152: U6.14 v38.15,25.3 | v25.2,25.29 U5.9
  Bottom 0.152: v25.2,25.29 25.4,25.29 25.41,25.3 v38.15,25.3
N$2  (via drill 0.35)
  Top 0.152: U7.14 v60.24,25.3 v60.25,25.3 | v44.5,25.3 U6.9
  Bottom 0.152: v60.25,25.3 v44.5,25.3
N$3  (via drill 0.35)
  Top 0.152: U8.14 v82.09,25.2 v82.1,25.19 | U7.9 v66.6,25.2
  Bottom 0.152: v82.1,25.19 v66.61,25.19 v66.6,25.2
N$4
  Top 0.152: U5.7 23.93,20.08 U11.1
N$5
  Top 0.152: U5.6 22.66,20.08 U11.2
N$8
  Top 0.152: U5.5 21.39,20.08 U11.3
N$9
  Top 0.152: R46.1 22.78,93.48 23.36,94.06 23.36,95.41 LED.A
N$10
  Top 0.152: U11.4 20.07,21.99 U5.4
N$11
  Top 0.152: U5.3 18.84,20.08 U11.5
N$12
  Top 0.152: U11.6 17.53,21.99 U5.2
N$13
  Top 0.152: U5.1 16.3,20.08 U11.7
N$14
  Top 0.152: U5.15 17.57,25.57 14.99,22.99 U11.8
N$15
  Top 0.152: U11.11 14.99,10.39 14.79,10.2 11.74,10.2 10.35,8.8 J11.1
N$16
  Top 0.152: U11.12 16.26,10.29 15.77,9.79 13.44,9.79 12.35,8.7 J11.2
N$17
  Top 0.152: J11.3 14.35,8.71 15.03,9.39 16.83,9.39 17.53,10.1 U11.13
N$18
  Top 0.152: J11.4 16.35,8.74 16.6,8.99 17.5,8.99 18.8,10.29 U11.14
N$20
  Top 0.152: U11.15 20.07,10.36 18.35,8.64 J11.5
N$21
  Top 0.152: J11.6 20.35,9.01 21.34,9.99 U11.16
N$22
  Top 0.152: U11.17 22.61,9.49 22.35,9.23 J11.7
N$23
  Top 0.152: J11.8 24.35,9.32 23.88,9.79 U11.18
N$24
  Top 0.152: U7.7 65.33,20.09 U13.1
N$25
  Top 0.152: U6.7 43.23,20.19 U12.1
N$26
  Top 0.152: U6.6 41.95,20.19 U12.2
N$27
  Top 0.152: U12.3 40.84,21.88 U6.5
N$28
  Top 0.152: U6.4 39.41,20.19 U12.4
N$29
  Top 0.152: U12.5 38.3,21.88 U6.3
N$30
  Top 0.152: U6.2 37.03,21.88 U12.6
N$31
  Top 0.152: U6.1 35.76,21.88 U12.7
N$32
  Top 0.152: U6.15 36.88,24.98 34.49,22.59 U12.8
N$33
  Top 0.152: J12.1 32.25,9.15 32.89,9.79 33.9,9.79 34.49,10.39 U12.11
N$34
  Top 0.152: J12.2 34.25,8.79 35.76,10.3 U12.12
N$35
  Top 0.152: U12.13 37.03,9.99 36.25,9.21 J12.3
N$36
  Top 0.152: U12.14 38.3,9.29 38.25,9.24 J12.4
N$37
  Top 0.152: U12.15 39.57,9.79 40.25,9.12 J12.5
N$38
  Top 0.152: J12.6 42.25,8.88 40.84,10.29 U12.16
N$39
  Top 0.152: J12.7 44.25,8.76 43.31,9.7 42.71,9.7 42.11,10.29 U12.17
N$40
  Top 0.152: U12.18 43.38,10.29 44.28,9.39 45.58,9.39 46.25,8.72 J12.8
N$41
  Top 0.152: U7.6 64.06,20.09 U13.2
N$42
  Top 0.152: U7.5 62.84,21.98 U13.3
N$43
  Top 0.152: U7.4 61.57,21.98 U13.4
N$44
  Top 0.152: U7.3 60.24,20.09 U13.5
N$45
  Top 0.152: U7.2 59.03,21.98 U13.6
N$46
  Top 0.152: U7.1 57.76,21.98 U13.7
N$47
  Top 0.152: U7.15 58.98,25.98 56.49,23.49 U13.8
N$48
  Top 0.152: J13.1 54.25,9.05 54.89,9.7 55.89,9.7 56.49,10.29 U13.11
N$49
  Top 0.152: J13.2 56.25,8.79 57.76,10.29 U13.12
N$50
  Top 0.152: U13.13 59.03,9.99 58.25,9.21 J13.3
N$51
  Top 0.152: U13.14 60.3,9.29 60.25,9.24 J13.4
N$52
  Top 0.152: U13.15 61.57,9.99 62.25,9.31 J13.5
N$53
  Top 0.152: J13.6 64.25,8.78 62.84,10.19 U13.16
N$54
  Top 0.152: J13.7 66.25,8.85 65.7,9.39 65.01,9.39 64.11,10.29 U13.17
N$55
  Top 0.152: U13.18 65.38,10.29 65.98,9.7 67.58,9.7 68.31,8.97 68.31,5.7 J13.8
N$56
  Top 0.152: U8.7 87.17,19.93 U14.1
N$57
  Top 0.152: U14.2 85.91,19.93 U8.6
N$58
  Top 0.152: U8.5 84.64,19.93 U14.3
N$59
  Top 0.152: U14.4 83.27,21.83 U8.4
N$60
  Top 0.152: U8.3 82,21.83 U14.5
N$61
  Top 0.152: U14.6 80.83,19.93 U8.2
N$62
  Top 0.152: U8.1 79.56,19.93 U14.7
N$63
  Top 0.152: U8.15 80.83,25.82 78.19,23.19 U14.8
N$64
  Top 0.152: U14.11 78.19,9.99 77.74,9.54 76.74,9.54 75.65,8.45 J14.1
N$65
  Top 0.152: U14.12 79.46,9.42 78.95,8.91 77.85,8.91 77.55,8.61 77.55,5.71 J14.2
N$66
  Top 0.152: U14.13 80.73,9.55 79.65,8.47 J14.3
N$67
  Top 0.152: U14.14 82,8.86 81.65,8.51 J14.4
N$68
  Top 0.152: J14.5 83.65,8.73 83.27,9.11 U14.15
N$69
  Top 0.152: U14.16 84.54,9.69 85.65,8.58 J14.6
N$70
  Top 0.152: J14.7 87.65,8.6 87.45,8.8 86.7,8.8 85.81,9.69 U14.17
N$71
  Top 0.152: U14.18 87.08,10.19 87.57,9.7 89.3,9.7 89.65,9.35 J14.8
N$72
  Top 0.152: U15.1 78.08,47.08 U9.7
N$73
  Top 0.152: U15.2 U9.6
N$74
  Top 0.152: U15.3 78.08,44.54 78.08,44.53 U9.5
N$75
  Top 0.152: U15.4 U9.4
N$76
  Top 0.152: 78.19,41.99 U9.3 U15.5
N$77
  Top 0.152: U15.6 U9.2
N$78
  Top 0.152: U8.9 88.44,32.06 81.71,38.8 77.07,38.8 73.87,41.99 U9.14
N$79
  Top 0.152: U15.7 78.4,39.46 78.39,39.45 U9.1
N$80
  Top 0.152: U15.8 76.81,38.19 74.28,40.73 U9.15
N$81
  Top 0.152: J15.1 91.14,35.25 90.5,35.89 90.5,37.59 89.91,38.19 U15.11
N$82
  Top 0.152: J15.2 91.35,37.25 90.91,37.7 90.91,38.56 90,39.46 U15.12
N$83
  Top 0.152: J15.3 91.36,39.25 89.88,40.73 U15.13
N$84
  Top 0.152: U15.14 90.25,42 91,41.25 J15.4
N$85
  Top 0.152: J15.5 89.12,43.25 U15.15
N$86
  Top 0.152: U15.16 90.29,44.54 91,45.25 J15.6
N$87
  Top 0.152: J15.7 91.25,47.25 89.81,45.81 U15.17
N$88
  Top 0.152: J15.8 91.25,49.25 91,49 91,48 90.08,47.08 U15.18
N$89
  Top 0.152: U16.1 U10.7
N$90
  Top 0.152: U10.6 U16.2
N$91
  Top 0.152: U16.3 U10.5
N$92
  Top 0.152: U10.4 U16.4
N$93
  Top 0.152: U16.5 U10.3
N$94
  Top 0.152: U10.2 U16.6
N$95
  Top 0.152: U16.7 U10.1
N$96  (via drill 0.35)
  Top 0.152: U10.14 v74.8,63.2 | v74.52,48.4 71.97,48.4 U9.9
  Bottom 0.152: v74.8,63.2 74.8,48.6 74.6,48.4 v74.52,48.4
N$97
  Top 0.152: U10.15 75.47,61.94 78.01,59.39 U16.8
N$98
  Top 0.152: U16.11 90.61,59.39 90.91,59.09 90.91,56.78 91.44,56.25 J16.1
N$99
  Top 0.152: J16.2 91.52,58.25 91.31,58.46 91.31,59.96 90.61,60.66 U16.12
N$100
  Top 0.152: J16.3 91.54,60.25 91.2,60.58 91.2,61.43 90.7,61.93 U16.13
N$101
  Top 0.152: U16.14 90.61,63.2 91.56,62.25 J16.4
N$102
  Top 0.152: J16.5 91.12,64.25 90.91,64.47 U16.15
N$103
  Top 0.152: U16.16 90.91,65.74 91.42,66.25 J16.6
N$104
  Top 0.152: J16.7 91.41,68.25 90.91,67.75 90.91,67.21 90.7,67.01 U16.17
N$105
  Top 0.152: J16.8 91.54,70.25 91.11,69.82 91.11,68.68 90.7,68.28 U16.18
N$120
  Top 0.152: VR8.1 6.35,18.47 5.7,17.82 J10.1
N$121
  Top 0.152: J9.1 5.7,27.82 6.35,28.47 VR7.1
N$122
  Top 0.152: J8.1 5.7,37.92 6.25,38.47 VR6.1
N$123
  Top 0.152: J7.1 5.7,47.92 6.25,48.47 VR5.1
N$124
  Top 0.152: J3.1 5.7,88.12 6.05,88.47 VR1.1
N$125
  Top 0.152: VR2.1 6.15,78.47 5.7,78.02 J4.1
N$126
  Top 0.152: J5.1 5.7,67.92 6.25,68.47 VR3.1
N$127
  Top 0.152: J6.1 5.7,58.02 6.15,58.47 VR4.1
N$128  (via drill 0.35)
  Top 0.152: R4.1 C9.2 30.55,62 v32,62 | v62.2,74.8 64.9,77.5 EN.S1 65.94,85.84 v66,85.9 | EN.S2 v66,90
  Bottom 0.152: v66,90 v66,85.9 | v32,62 42.8,62 55.6,74.8 v62.2,74.8
N$129  (via drill 0.35)
  Top 0.152: v69.6,85.8 69.56,85.84 IO0.S1 68.53,80.03 v62.1,73.6 | v69.6,90 IO0.S2 | v32,55.1 30.42,55.1 C10.2 R6.1
  Bottom 0.152: v69.6,85.8 v69.6,90 | v32,55.1 36.9,60 42.2,60 55.8,73.6 v62.1,73.6
N$130  (via drill 0.35)
  Top 0.152: LED4.C 21.9,97.9 22.41,98.41 23.99,98.41 24.4,98 24.4,88.99 24.89,88.5 v24.89,84.9 | v24.87,82.51 25.2,82.18 25.2,72.19 26.25,71.14 28.25,71.14 28.55,71.44 U2.17
  Bottom 0.152: v24.87,82.51 24.89,82.51 v24.89,84.9
N$131  (via drill 0.35)
  Top 0.152: U2.10 32.36,69.18 v30.45,71.09 | v30.45,74.6 30.45,79.75 32.3,81.6 v32.3,82.6 | LED5.C 20.4,98.91 24,98.91 25.57,97.34 25.57,85.03 26.79,83.8 v26.79,83.3
  Bottom 0.152: v30.45,71.09 v30.45,74.6 | v32.3,82.6 26.79,82.6 v26.79,83.3
N$132
  Top 0.152: LED4.A 21.9,94.65 20.63,93.38 R7.1
N$133
  Top 0.152: LED5.A 20.4,94.66 19.5,93.76 18.8,93.76 18.43,93.39 R8.1
N$134
  Top 0.152: LED6.A 18.9,94.92 17.84,93.86 16.69,93.86 16.23,93.4 R9.1
N$136
  Top 0.152: R14.1 20.03,71.91 Q2.B
N$137
  Top 0.152: R19.1 20.08,68.54 Q3.B
RCK  (via drill 0.35)
  Top 0.152: U10.12 72.55,65.8 v71,65.8 | U8.12 84.64,29.96 v84.6,30 | U5.12 21.39,30.58 23.8,33 v40.7,33 v62.8,33 v67,33 v84.6,33 | v67,77 v67,65.8 v67,44.6 v67,37 | U7.12 62.78,29.98 v62.8,30 | U6.12 40.69,29.98 v40.7,30 | U3.12 v42.13,78.43 v42.14,78.42 | v70,44.5 71.99,44.5 U9.12
  Bottom 0.152: v84.6,30 v84.6,33 | v67,37 v67,33 | v71,65.8 v67,65.8 | v70,44.5 67.1,44.5 v67,44.6 | v62.8,30 v62.8,33 | v40.7,30 v40.7,33 | v67,77 65.58,78.42 v42.14,78.42
RTS  (via drill 0.35)
  Top 0.152: v21.8,70.98 21.8,70.1 Q2.E | U2.2 27.28,66.22 26.87,65.81 21.34,65.81 20.9,66.25 v20.9,66.74 R19.2
  Bottom 0.152: v21.8,70.98 21.54,70.72 20.68,70.72 20.35,70.39 20.35,69.93 20.9,69.38 v20.9,66.74
RXD  (via drill 0.35)
  Top 0.152: U2.4 28.55,67.58 24.3,71.83 v24.3,87.3 | v57.3,88.5 58.78,88.5 58.8,88.52 U3.35
  Bottom 0.152: v57.3,88.5 55.7,86.9 24.7,86.9 v24.3,87.3
SCK  (via drill 0.35)
  Top 0.152: U8.11 v85.91,30 v85.9,30 | U5.11 22.66,30.09 24.57,32 v42,32 v64,32 v68,32 v85.9,32 | v68,78 v68,67 v68,45.8 v68,36 | U10.11 71.02,67.02 v71,67 | U7.11 64.06,29.95 v64,30 | U6.11 41.95,29.95 v42,30 | U3.9 41.66,82.24 42.2,81.7 v42.2,79.4 | v70,45.8 U9.11
  Bottom 0.152: v85.9,30 v85.9,32 | v68,36 v68,32 | v71,67 v68,67 | v70,45.8 v68,45.8 | v64,30 v64,32 | v42,30 v42,32 | v42.2,79.4 42.87,78.73 67.27,78.73 v68,78
SCL  (via drill 0.35)
  Top 0.152: v69,79 v69,68.3 v69,47.1 v69,35 | U5.10 23.93,29.93 25,31 v43.2,31 v65.3,31 v69,31 v87,31 | U8.10 87.17,29.98 v87.15,30 | U10.10 71.02,68.28 v71,68.3 | U7.10 65.33,29.98 v65.3,30 | U6.10 43.23,29.98 v43.2,30 | U3.8 41.99,83.51 43.4,82.1 43.4,80.5 v43,80.1 | v70,47.1 70.03,47.08 U9.10
  Bottom 0.152: v87.15,30 87,30.15 v87,31 | v69,35 v69,31 | v71,68.3 v69,68.3 | v70,47.1 v69,47.1 | v65.3,30 v65.3,31 | v43.2,30 v43.2,31 | v43,80.1 43,80 43.3,79.7 68.3,79.7 v69,79
SER  (via drill 0.35)
  Top 0.152: U5.14 18.84,30.84 23,35 61,35 65,39 v65,75.01 | U3.14 v42.09,75.89 v42.1,75.9
  Bottom 0.152: v42.1,75.9 42.92,75.9 43.47,76.45 63.57,76.45 v65,75.01
TXD  (via drill 0.35)
  Top 0.152: v25.5,84 25.53,83.97 25.53,72.55 25.84,72.24 U2.20 | U3.34 58.78,87.3 v57.3,87.3
  Bottom 0.152: v25.5,84 26.3,84.8 56.4,84.8 57.3,85.7 v57.3,87.3
VBUS3  (via drill 0.35)
  Top 0.152: U1.1 C1.1 | R9.2 15.34,91 v15.32,91.02
  Top 0.406: J1.VCC 10.7,93.3 v10.2,92.8
  Top 0.508: U1.1 28.44,91.32 28.07,91.7 28.07,92.55 v28.06,92.56
  Bottom 0.152: v15.32,91.02 15.32,92.14 14.9,92.56
  Bottom 0.508: v28.06,92.56 14.9,92.56 12.09,92.56 11.72,92.92 10.99,92.92 10.88,92.82 10.9,92.8 v10.2,92.8
VSPI_CLK  (via drill 0.35)
  Top 0.152: v23.4,78.3 22.86,78.84 U4.13 | U3.30 57.24,82.24 v57.1,82.1
  Bottom 0.152: v57.1,82.1 41,82.1 35.4,82.1 33.4,80.1 25.2,80.1 v23.4,78.3
VSPI_CS0  (via drill 0.35)
  Top 0.152: v23.4,77.1 21.8,77.1 21.51,77.39 U4.12 | U3.29 57.17,80.97 v57.1,80.9
  Bottom 0.152: v57.1,80.9 35.2,80.9 33.7,79.4 25.7,79.4 v23.4,77.1
VSPI_HD  (via drill 0.35)
  Top 0.152: U3.33 59.65,86.05 61.34,84.36 61.34,76 61.74,75.61 v61.9,75.61
  Bottom 0.152: v61.9,75.61 62.15,75.36 62.63,75.36 62.96,75.03 62.96,73.46 49.7,60.2 45.8,60.2 45.33,59.73 J20.P$4
VSPI_ID  (via drill 0.35)
  Top 0.152: U4.14 v23.4,79.34 | U3.37 58.86,91.07 v60.3,91.07
  Bottom 0.152: v23.4,79.34 25.03,80.97 32.3,80.97 34.27,82.94 57.47,82.94 60.3,85.77 v60.3,91.07
VSPI_IQ  (via drill 0.35)
  Top 0.152: v23.4,80.21 23.03,79.84 U4.15 | U3.31 v57.2,83.5
  Bottom 0.152: v23.4,80.21 24.49,81.3 32.1,81.3 34.86,84.06 56.64,84.06 v57.2,83.5
VSPI_WP  (via drill 0.35)
  Top 0.152: LED.C v23.4,97.8 | v57.4,89.8 58.74,89.8 U3.36
  Bottom 0.152: v23.4,97.8 23.4,97.19 26.93,93.67 39.02,93.67 45.29,87.4 53.1,87.4 55.5,89.8 v57.4,89.8

### Text on the board
tPlace: 33 | 7 | 6 | 5 | 4 | GND | IO21 | IO35 | IO34 | IO39 | IO36 | +3V3 | +24V | 16 | 23 | 24 | 26 | 27 | 28 | IO2 | IO4 | IO13 | IO15 | IO16 | IO17 | Designed by @stop_pattern | Speedometer Drive Board rev.1